# EAGLE design esp12f_all pin (EAGLE 7.2.0)
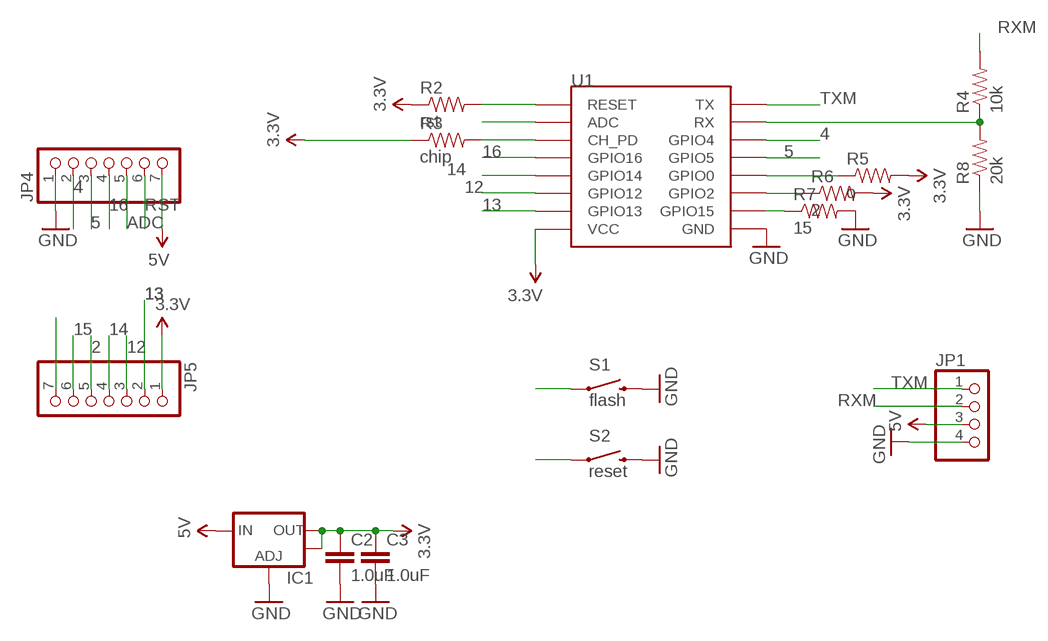
[diagram p0: schematic, sheet 1]

## Parts
C2  1.0uF  1.0UF50V10%(1206)  [1206]
C3  1.0uF  1.0UF50V10%(1206)  [1206]
IC1  V_REG_LM1117SOT223  [SOT223]
JP1  PINHD-1X4  [1X04]
JP4  PINHD-1X7  [1X07]
JP5  PINHD-1X7  [1X07]
R2  rst  0.3OHM-1/8W-1%(0805)  [0805]
R3  chip  0.3OHM-1/8W-1%(0805)  [0805]
R4  10k  0.3OHM-1/8W-1%(0805)  [0805]
R5  o  0.3OHM-1/8W-1%(0805)  [0805]
R6  2  0.3OHM-1/8W-1%(0805)  [0805]
R7  15  0.3OHM-1/8W-1%(0805)  [0805]
R8  20k  0.3OHM-1/8W-1%(0805)  [0805]
S1  flash  SWITCH-MOMENTARY-2SMD-1101NE  [TACTILE-SWITCH-1101NE]
S2  reset  SWITCH-MOMENTARY-2SMD-1101NE  [TACTILE-SWITCH-1101NE]
U1  ESP12SMD  [ESP12-SMD]

## Nets
0: JP5.7 R5.1 S1.1 U1.GPIO0
2: JP5.5 R6.1 U1.GPIO2
3.3V: C2.1 C3.1 IC1.2(OUT) IC1.4(OUT) JP5.1 R2.1 R3.1 R5.2 R6.2 U1.VCC
4: JP4.2 U1.GPIO4
5: JP4.3 U1.GPIO5
5V: IC1.3(IN) JP1.3 JP4.7
12: JP5.3 U1.GPIO12
13: JP5.2 U1.GPIO13
14: JP5.4 U1.GPIO14
15: JP5.6 R7.1 U1.GPIO15
16: JP4.4 U1.GPIO16
ADC: JP4.5 U1.ADC
CH_PD: R3.2 U1.CH_PD
GND: C2.2 C3.2 IC1.1(ADJ) JP1.4 JP4.1 R7.2 R8.1 S1.2 S2.2 U1.GND
N$7: R4.1 R8.2 U1.RXD0(RX)
RST: JP4.6 R2.2 S2.1 U1.RESET
RXM: JP1.2 R4.2
TXM: JP1.1 U1.TXD0(TX)

## Library data of the parts
C2 C3 = SparkFun-Capacitors:1.0UF50V10%(1206): CAP-09822; PROD_ID: CAP-09822
IC1 = SparkFun-PowerIC:V_REG_LM1117: Voltage Regulator LM1117 Standard adjustable voltage regulator but in SMD form. Spark Fun Electronics SKU : COM-00595; PROD_ID: VREG-08170
JP1 = pinhead2:PINHD-1X4: PIN HEADER
JP4 JP5 = pinhead:PINHD-1X7: PIN HEADER
R2-R8 = SparkFun-Resistors:0.3OHM-1/8W-1%(0805): RES-11622; PROD_ID: RES-11622; VALUE: 0.3
S1 S2 = SparkFun-Electromechanical:SWITCH-MOMENTARY-2: Various NO switches- pushbuttons, reed, etc; PROD_ID: SWCH-00815
U1 = esp8266modules:ESP12: ESP8266 Wifi module 12

## Board
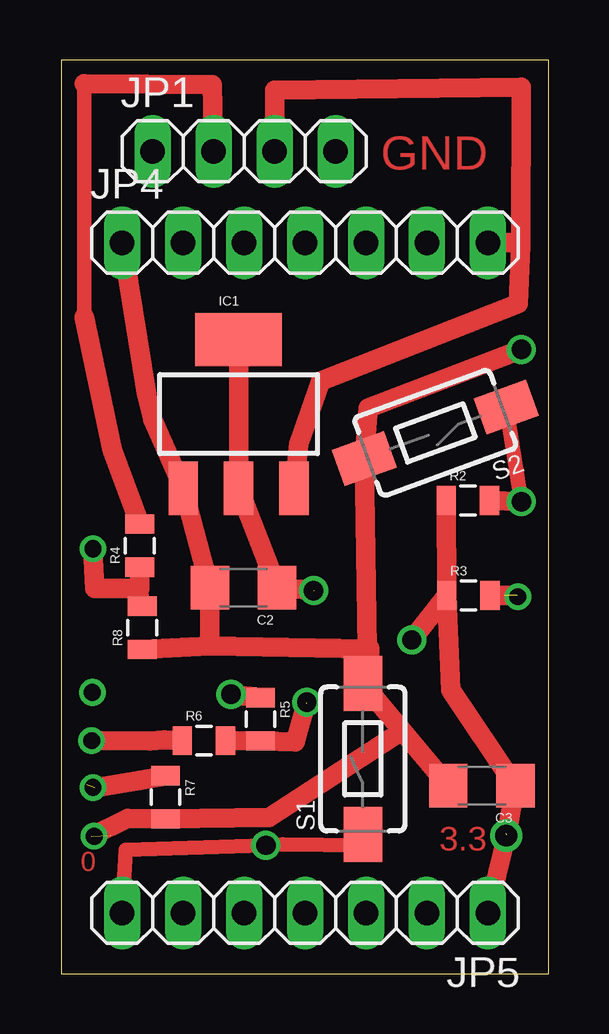
[diagram p1: board, top side]
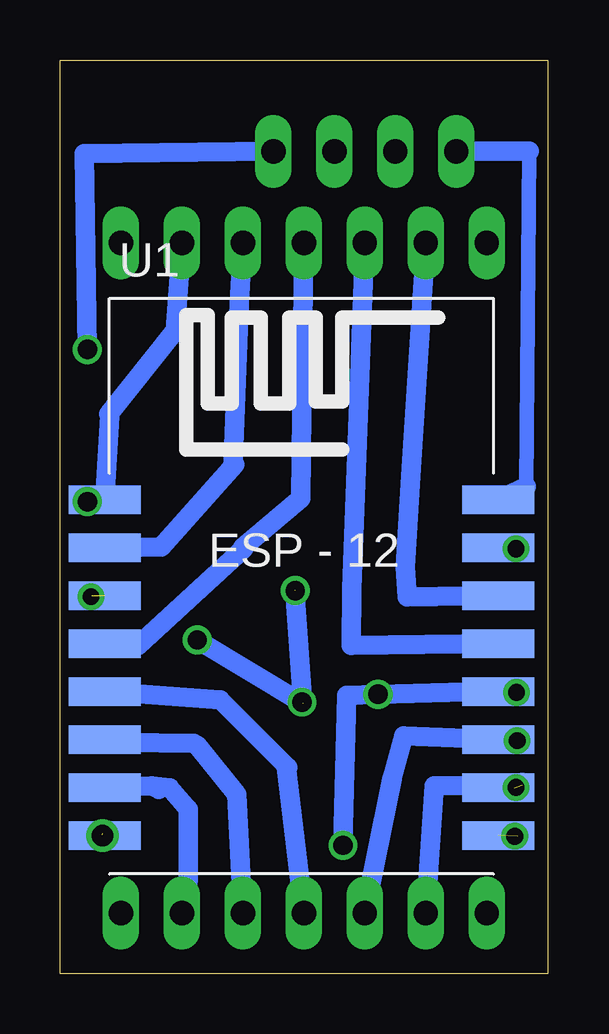
[diagram p2: board, bottom side, seen from below]

Size 20.32 x 38.1 mm. Coordinates in mm from the lower left corner, seen from the top.
Outline: 0,0 20.32,0 20.32,38.1 0,38.1 0,0
Copper layers (1*16): Top 0.035mm / dielectric 1.5mm / Bottom 0.035mm
Design rules "default *": minimum track width 20mil, minimum drill 24mil, track to track 8mil, track to pad 8mil, pad to pad 8mil, via to via 8mil, smd to smd 8mil, copper to edge 40mil, drill to drill 8mil, minimum pad ring 10mil, minimum via ring 8mil, stop-mask expansion 4mil, vias tented up to drill 0mil, thermal gap 10mil

### Footprints (pad centres in the part's own frame; a part is rotated, then mirrored left to right if it is on the bottom)
1206 = smd 1.6 x 1.8: 1 -1.4,0; 2 1.4,0
SOT223 = smd 1.219 x 2.235: 1 -2.311,-3.099; 2 0,-3.099; 3 2.311,-3.099 | smd 3.6 x 2.2: 4 0,3.099
1X04 = drill 1.016 long: 1 -3.81,0; 2 -1.27,0; 3 1.27,0; 4 3.81,0
1X07 = drill 1.016 long: 1 -7.62,0; 2 -5.08,0; 3 -2.54,0; 4 0,0; 5 2.54,0; 6 5.08,0; 7 7.62,0
0805 = smd 0.8 x 1.2: 1 -0.9,0; 2 0.9,0
TACTILE-SWITCH-1101NE = smd 2.3 x 1.6: 1 -3.15,0; 2 3.15,0
ESP12-SMD = smd 3 x 1.2: ADC -8.3,3.8; CH_PD -8.3,1.8; GND 8.1,-8.2; GPIO0 8.1,-2.2; GPIO2 8.1,-4.2; GPIO4 8.1,1.8; GPIO5 8.1,-0.2; GPIO12 -8.3,-4.2; GPIO13 -8.3,-6.2; GPIO14 -8.3,-2.2; GPIO15 8.1,-6.2; GPIO16 -8.3,-0.2; RESET -8.3,5.8; RXD0 8.1,3.8; TXD0 8.1,5.8; VCC -8.3,-8.2

### Placement (x,y rotation side)
C2  7.59,16.1 180 top
C3  17.53,7.85 180 top
IC1  7.39,23.34 0 top
JP1  7.62,34.29 0 top
JP4  10.16,30.48 0 top
JP5  10.16,2.54 180 top
R2  16.94,19.74 0 top
R3  16.97,15.77 0 top
R4  3.28,17.86 90 top
R5  8.31,10.62 270 top
R6  5.94,9.73 0 top
R7  4.34,7.37 270 top
R8  3.38,14.43 90 top
S1  12.57,8.96 90 top
S2  15.59,22.55 200 top
U1  10.16,13.97 0 bottom

### Tracks (layer width: path | path; a pad name or v marks a point on that pad's centre or on a via)
0  (via drill 0.8)
  Top 0.61: JP5.7 2.69,5.18 v8.53,5.36 9.22,5.4 12.6,5.36 S1.1
  Top 0.813: 7.04,11.63 R5.1 v7.09,11.66
  Top 1.016: 12.6,6.36 S1.1
  Bottom 0.813: 2.9,11.81 3.35,11.76 v7.09,11.66 8.37,11.61 v8.53,5.36
  Bottom 1.016: U1.GPIO0 2.9,11.81
2  (via drill 0.7)
  Top 0.813: v1.27,9.73 3.69,9.72 4.32,9.75 R6.1
  Bottom 0.508: v1.27,9.73 1.91,9.53 U1.GPIO2
  Bottom 0.813: JP5.5 6.48,8.18 5.99,9.93 v1.27,9.73
3.3V  (via drill 0.8)  (3 unrouted)
  Top 0.813: IC1.4 IC1.2 C2.1 10.52,15.98 | R3.1 R2.1 | JP5.1 18.56,5.79 C3.1 16.23,11.84 R3.1 | R6.2 R5.2 9.75,9.68 10.21,11.3 | R3.1 v14.61,13.92
  Bottom 0.813: U1.VCC 18.54,5.87 | v14.61,13.92 10.21,11.28 10.54,15.99
4
  Bottom 0.813: JP4.2 5.71,20.75 5.94,16.97 5.84,15.72 U1.GPIO4
5
  Bottom 0.813: JP4.3 8.15,16.05 8.18,13.69 U1.GPIO5
5V
  Top 0.508: 19.05,30.48 19.15,30.36
  Top 0.813: IC1.3 9.91,22.1 10.82,24.71 19.05,27.94 19.15,30.36 19.18,36.96 8.89,36.83 JP1.3 | 19.05,30.48 JP4.7
12
  Bottom 0.508: 14.61,9.53 14.76,9.6
  Bottom 0.813: 14.76,9.6 19.1,9.68 | JP5.3 12.95,7.49 14.61,9.53
  Bottom 1.016: 19.1,9.68 U1.GPIO12
13
  Bottom 0.813: U1.GPIO13 16.51,7.83 | 16.51,7.83 16.2,7.7 | JP5.2 14.99,3.94 14.99,6.86 15.75,7.75 16.51,7.83
14
  Bottom 0.61: 10.82,8.61 10.9,8.64
  Bottom 0.813: U1.GPIO14 13.64,11.43 10.82,8.61 | 10.9,8.64 JP5.4
15  (1 unrouted)
  Top 0.508: 2.41,8 3.28,8.06
  Top 0.813: R7.1 3.28,8.06 1.4,7.75
  Bottom 0.813: JP5.6 4.72,7.85 1.07,7.87
  Bottom 1.016: 1.07,7.87 1.63,7.7 U1.GPIO15
16
  Bottom 0.508: 12.7,17.78 12.67,17.74
  Bottom 0.61: 12.62,17.78 12.67,17.74
  Bottom 0.813: 12.67,17.74 17.07,13.69 U1.GPIO16 | JP4.4 10.29,19.81 12.7,17.78
ADC
  Bottom 0.508: 13.11,21.44 16.1,17.79
  Bottom 0.813: U1.ADC 16.1,17.79 13.03,21.23 | JP4.5 12.85,27.96 13.11,21.44
CH_PD  (1 unrouted)
  Top 0.813: R3.2 19,15.77
GND  (via drill 0.8)  (1 unrouted)
  Top 0.813: v19.18,26.04 12.8,23.6 S2.2 12.74,13.55 6.2,13.66 | JP4.1 3.56,24.13 3.81,23.11 IC1.1 C2.2 6.2,13.66 | R8.1 6.2,13.66 | S1.2 14.22,10.14 | 14.22,10.14 C3.2 | 1.25,5.74 2.77,6.48 R7.2 8.66,6.53 14.22,10.14
  Top 1.016: 12.74,13.55 12.75,13.06 S1.2
  Bottom 0.813: JP1.4 19.3,34.19 v19.18,26.04
N$3  (via drill 0.9)
  other vias: 18.54,5.77
N$4  (via drill 0.7)
  other vias: 1.37,5.74
N$5  (via drill 0.7)
  other vias: 1.32,7.77
N$7  (via drill 0.7)
  Top 0.61: R4.1 R8.2
  Top 0.813: R4.1 3.28,16.08 1.4,16.08 v1.32,17.72
  Bottom 0.813: v1.32,17.72 U1.RXD0
N$8  (via drill 0.7)
  other vias: 1.3,11.73
N$9  (via drill 0.8)
  other vias: 7.06,11.66
N$10  (via drill 0.8)
  other vias: 10.52,15.98
N$11  (via drill 0.7)
  other vias: 1.32,17.73
N$14  (via drill 0.8)
  other vias: 10.24,11.33
N$15  (via drill 0.7)
  other vias: 19.02,15.72
N$21  (via drill 0.8)
  other vias: 19.18,26.04
N$24  (via drill 0.7)
  other vias: 19.18,19.68
RST  (via drill 0.8)
  Top 0.61: v19.18,19.68 S2.1
  Top 0.813: R2.2 v19.18,19.68
  Bottom 0.508: 18.29,23.34 U1.RESET
  Bottom 0.813: 18.25,23.27 U1.RESET 17.77,19.79 v19.18,19.68 | JP4.6 15.52,26.82 18.29,23.34
RXM
  Top 0.61: 0.96,27.38 0.96,37.11
  Top 0.813: R4.2 2.13,21.84 0.96,27.38 | 0.96,37.11 6.3,37.06 JP1.2
TXM
  Bottom 0.61: 0.89,20.32 0.76,34.29
  Bottom 0.813: 0.76,34.29 JP1.1 | U1.TXD0 0.89,20.32

### Text on the board
Top: GND | 3.3 | 0